# Altium schematic sheet 7_sdcard.SchDoc
size A4
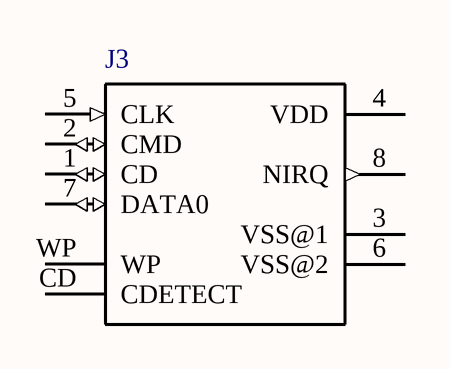
[diagram p0: 7_sdcard.SchDoc]

## Parts
J3  1734472-1  [TYCO_1734472-1_1734472-1(Primary)]  (value not drawn)

## Nets

Not connected (* = marked no-connect by the designer): J3 1(CD) 2(CMD) 3(VSS@1) 4(VDD) 5(CLK) 6(VSS@2) 7(DATA0) 8(NIRQ) CD(CDETECT) WP

## Library data of the parts
J3 = 1734472-1: SD Card Connector,PushPushType; MF: TE Connectivity; Package: None; MP: 1734472-1; SnapEDA_Link: https://www.snapeda.com/parts/1734472-1/TE%2520Connectivity%2520AMP%2520Connectors/view-part/?ref=snap; Availability: Unavailable; Price: None; Value: *